# EAGLE design Power Watchdog (EAGLE 9.5.2)
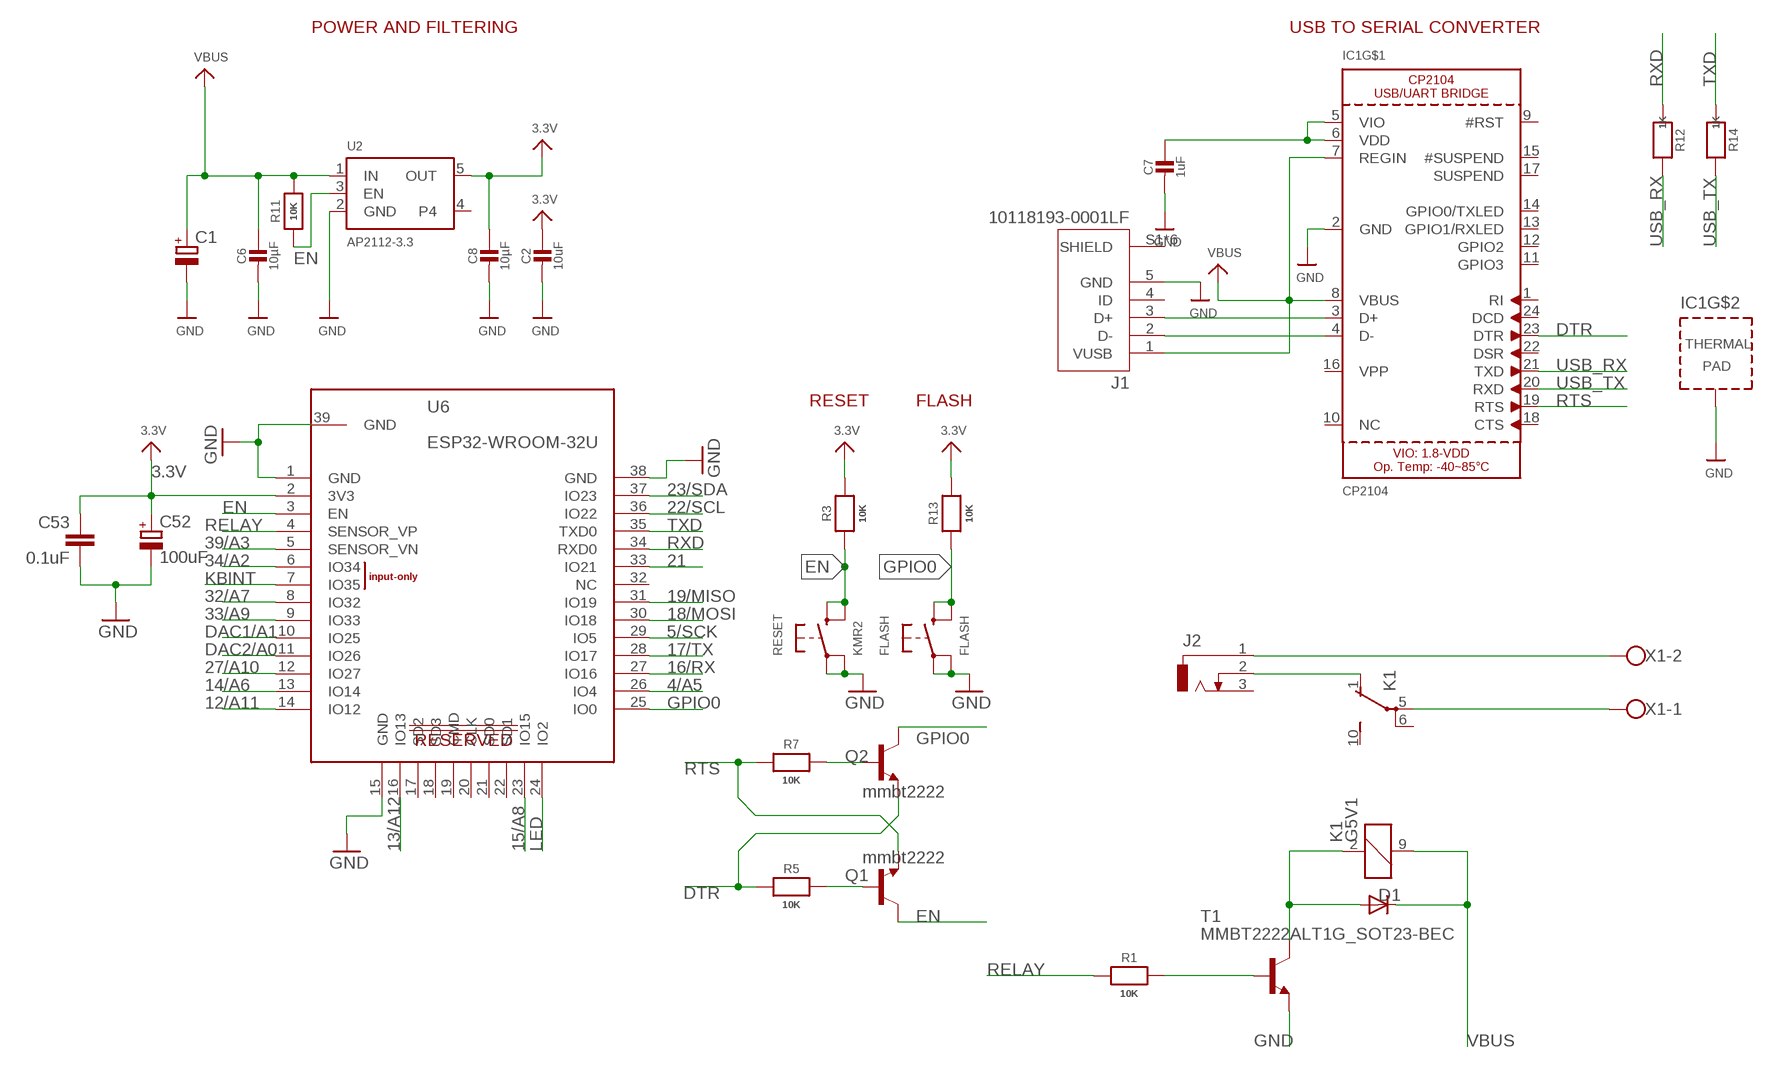
[diagram p0: schematic, sheet 1]

## Parts
C1  CPOL-EUE3.5-10  [E3,5-10]
C2  10uF  CAP_CERAMIC0805-NOOUTLINE  [0805-NO]
C6  10µF  CAP_CERAMIC0805-NOOUTLINE  [0805-NO]
C7  1uF  CAP_CERAMIC0603_NO  [0603-NO]
C8  10µF  CAP_CERAMIC0805-NOOUTLINE  [0805-NO]
C52  100uF  CPOL-EUC/6032-28R  [C/6032-28R]
C53  0.1uF  C-EUC0603  [C0603]
D1  DIODESMB  [SMB-DIODE]
FLASH  FLASH  SWITCH_TACT_SMT4.6X2.8  [BTN_KMR2_4.6X2.8]
IC1  CP2104  [QFN24_4MM_SMSC]
J1  10118193-0001LF  [FCI_10118193-0001LF]
J2  DCJ0303  [DCJ0303]
K1  G5V1  [G5V1]
Q1  mmbt2222  TRANSISTOR_NPNSOT23-3  [SOT23-3]
Q2  mmbt2222  TRANSISTOR_NPNSOT23-3  [SOT23-3]
R1  10K  RESISTOR_0603_NOOUT  [0603-NO]
R3  10K  RESISTOR_0603_NOOUT  [0603-NO]
R5  10K  RESISTOR_0603_NOOUT  [0603-NO]
R7  10K  RESISTOR_0603_NOOUT  [0603-NO]
R11  10K  RESISTOR_0603_NOOUT  [0603-NO]
R12  1K  RESISTOR_0603_NOOUT  [0603-NO]
R13  10K  RESISTOR_0603_NOOUT  [0603-NO]
R14  1K  RESISTOR_0603_NOOUT  [0603-NO]
RESET  KMR2  SWITCH_TACT_SMT4.6X2.8  [BTN_KMR2_4.6X2.8]
T1  MMBT2222ALT1G_SOT23-BEC  [SOT23-BEC]
U2  AP2112-3.3  VREG_SOT23-5  [SOT23-5]
U6  ESP32-WROOM-32U  [ESP32WROOM32D]
X1  W237-102  [W237-102]

## Nets
3.3V [3v3]: C2.1 C8.1 C52.+ C53.1 R3.2 R13.2 U2.5(OUT) U6.2(3V3)
4/A5: U6.26(IO4)
5/SCK: U6.29(IO5)
12/A11: U6.14(IO12)
13/A12: U6.16(IO13)
14/A6: U6.13(IO14)
15/A8: U6.23(IO15)
16/RX: U6.27(IO16)
17/TX: U6.28(IO17)
18/MOSI: U6.30(IO18)
19/MISO: U6.31(IO19)
21: U6.33(IO21)
22/SCL: U6.36(IO22)
23/SDA: U6.37(IO23)
27/A10: U6.12(IO27)
32/A7: U6.8(IO32)
33/A9: U6.9(IO33)
34/A2: U6.6(IO34)
39/A3: U6.5(SENSOR_VN)
DAC1/A1: U6.10(IO25)
DAC2/A0: U6.11(IO26)
DTR: IC1.23(DTR) Q2.2(E) R5.1
EN: Q1.3(C) R3.1 R11.1 RESET.B'(S1) RESET.B(S) U2.3(EN) U6.3(EN)
GND: C1.- C2.2 C6.2 C7.2 C8.2 C52.- C53.2 FLASH.A'(P1) FLASH.A(P) IC1.2(GND) IC1.THERM(TP) J1.5(GND) RESET.A'(P1) RESET.A(P) T1.E U2.2(GND) U6.1(GND) U6.15(GND) U6.38(GND) U6.39(GND)
GPIO0: FLASH.B'(S1) FLASH.B(S) Q2.3(C) R13.1 U6.25(IO0)
KBINT: U6.7(IO35)
LED: U6.24(IO2)
N$1: R1.2 T1.B
N$2: D1.A K1.2 T1.C
N$3: J2.1 X1.2
N$4: J2.2 K1.1(2:O)
N$5: K1.5(2:P) X1.1
N$6: IC1.3(D+) J1.3(D+)
N$7: IC1.4(D-) J1.2(D-)
N$9: C7.1 IC1.5(VIO) IC1.6(VDD)
N$12: Q1.1(B) R5.2
N$13: Q2.1(B) R7.2
RELAY: R1.1 U6.4(SENSOR_VP)
RTS: IC1.19(RTS) Q1.2(E) R7.1
RXD: R12.1 U6.34(RXD0)
TXD: R14.1 U6.35(TXD0)
USB_RX: IC1.21(TXD) R12.2
USB_TX: IC1.20(RXD) R14.2
VBUS [vcc]: C1.+ C6.1 D1.C IC1.7(REGIN) IC1.8(VBUS) J1.1(VUSB) K1.9 R11.2 U2.1(IN)
Unconnected: IC1.1(RI) IC1.9(#RST) IC1.10(NC) IC1.11(GPIO3) IC1.12(GPIO2) IC1.13(GPIO1/RXLED) IC1.14(GPIO0/TXLED) IC1.15(#SUSPEND) IC1.16(VPP) IC1.17(SUSPEND) IC1.18(CTS) IC1.22(DSR) IC1.24(DCD) J1.4(ID) J1.S1(SHIELD) J1.S2(SHIELD) J1.S3(SHIELD) J1.S4(SHIELD) J1.S5(SHIELD) J1.S6(SHIELD) J2.3 K1.6(2:P) K1.10(2:S) U2.4 U6.17(SD2) U6.18(SD3) U6.19(CMD) U6.20(CLK) U6.21(SD0) U6.22(SD1) U6.32(NC)

## Notes on the sheet
- POWER AND FILTERING | USB TO SERIAL CONVERTER
- RESET | FLASH
- RESERVED

## Library data of the parts
C1 = rcl:CPOL-EU: POLARIZED CAPACITOR, European symbol; SPICEPREFIX: C
C2 C6-C8 = microbuilder:CAP_CERAMIC: Ceramic Capacitors For new designs, use the packages preceded by an '_' character since they are more reliable: The following footprints should be used on most boards: _0402 - Standard footprint for regular board layouts _0603 - Standard footprint for regular board layouts _0805 - Standard footprint for regular board layouts _1206 - Standard footprint for regular board layouts For extremely tight-pitch boards where space is at a premium, the following 'micro-pitch' footprints can be used (smaller pads, no silkscreen outline, etc.): _0402MP - Micro-pitch footprint for very dense/compact boards _0603MP - Micro-pitch footprint for very dense/compact boards _0805MP - Micro-pitch footprint for very dense/compact boards _1206MP - Micro-pitch footprint for very dense/compact boards
C52 = rcl:CPOL-EU: POLARIZED CAPACITOR, European symbol
C53 = rcl:C-EU: CAPACITOR, European symbol
D1 = oriSparkFun:DIODE: Diode These are standard reverse protection diodes and small signal diodes. SMA package can handle up to about 1A. SOD-323 can handle about 200mA. What the SOD-323 package when ordering, there are some mfgs out there that are 5-pin packages.
FLASH RESET = microbuilder:SWITCH_TACT_SMT: SMT Tact Switches 6x6mm - Digikey: P12940SCT-ND KMR2 (4.6x2.8mm) - Digikey: 401-1426-1-ND EVQ-PQHB55 - Light Touch, 160GF (4.5x4.5mm) - Digikey: P8090SCT-ND KMT0 - KMT021 NGJ LHS (etc.) IP68/Waterproof - Digikey: CKN10289CT-ND
IC1 = microbuilder:CP2104: CP2104 - USB to UART Bridge VDD Output: 3.45V
J1 = 10118193-0001LF:10118193-0001LF: Micro USB B Type Receptacle; DESCRIPTION: USB - micro B USB 2.0 Receptacle Connector 5 Position Surface Mount, Right Angle; Through Hole; DIGI-KEY_PART_NUMBER: 609-4616-1-ND; DIGI-KEY_PURCHASE_URL: https://www.digikey.com/product-detail/en/amphenol-icc-fci/10118193-0001LF/609-4616-1-ND/2785380?utm_source=snapeda&utm_medium=aggregator&utm_campaign=symbol; MF: Amphenol ICC; MP: 10118193-0001LF; PACKAGE: None
J2 = con-jack:DCJ0303: DC POWER JACK Source: DCJ0303.pdf; OC_FARNELL: unknown; OC_NEWARK: unknown
K1 = relay:G5V1: RELAY 1 x switch, 0.5 A/125 V AC, 1 A/24 V DC , Omron; MPN: G5V-1-DC24; OC_FARNELL: 9949593; OC_NEWARK: 36M6377
Q1 Q2 = SparkFun:TRANSISTOR_NPN: Transistor NPN BJT configuration in SOT23 package. MMBT2222 is the common NPN we use. Double check BCE configuration again layout.
R1 R3 R5 R7 R11-R14 = microbuilder:RESISTOR: Resistors For new designs, use the packages preceded by an '_' character since they are more reliable: The following footprints should be used on most boards: _0402 - Standard footprint for regular board layouts _0603 - Standard footprint for regular board layouts _0805 - Standard footprint for regular board layouts _1206 - Standard footprint for regular board layouts For extremely tight-pitch boards where space is at a premium, the following 'micro-pitch' footprints can be used (smaller pads, no silkscreen outline, etc.): _0402MP - Micro-pitch footprint for very dense/compact boards _0603MP - Micro-pitch footprint for very dense/compact boards _0805MP - Micro-pitch footprint for very dense/compact boards _1206MP - Micro-pitch footprint for very dense/compact boards
T1 = Boobie:MMBT2222ALT1G: NPN Transistor
U2 = microbuilder:VREG_SOT23-5: SOT23-5 Fixed Voltage Regulators Part Current Out V Out V In V Dropout θJA (°C/W) TJ (°C) Digikey Part No. ADP121 150mA 3.3V 3.4-5.5V 0.09V @ 150mA -- -- ADP121-AUJZ33R7CT-ND ADP121 150mA 3.0V 3.1-5.5V 0.09V @ 150mA -- -- ADP121-AUJZ30R7CT-ND ADP122 300mA 3.3V 3.4-5.5V 0.085V @ 300mA -- -- ADP122AUJZ-3.3-R7CT-ND ADP1712 300mA 3.3V 3.5-5.5V 0.17V @ 300mA -- -- ADP1712AUJZ-3.3-R7TR-ND AP7311 (Low Cost) 150mA 3.3V 3.5-6V 0.15V @ 150mA -- -- AP7311-33WG-7DICT-ND LD39015M18R 150mA 1.8V 1.9V-5.5V 0.08V @ 100mA -- -- 497-6977-1-ND LP2985A-33DBVR 150mA 3.3V 3.3-16V 0.28V @ 150mA 206 150 296-18479-1-ND MCP1824T-3302E/OT 300mA 3.3V 3.5V-6V 0.2V @ 300mA -- -- MCP1824T-3302E/OTCT-ND MIC5205-2.5YM5 TR 150mA 2.5V 2.7-16V 0.165V @ 150mA -- -- 576-1257-2-ND MIC5205-3.0YM5 TR 150mA 3.0V 3.2V-16V 0.165V @ 150mA -- -- 576-1258-2-ND MIC5205-3.3YM5 TR 150mA 3.3V 3.5V-16V 0.165V @ 150mA -- -- 576-1259-2-ND TPS780330220 150mA 3.3V+2.2V 3.6-5.5V 250mV Max -- -- 296-23332-1-ND TDA3663/N1,135 100mA 3.3V 3.5-45V 0.18V @ 50mA -- -- 568-5343-1-ND Max operating temp can be calculated using θJA, TJ (max junction temperature), and power in watts. Set the "Maximum Ambient Temperature" until it reaches TJ ("Max Junction Temperature"), which is the absolute limit for safe use of the regulator: Heat Sink Temperature Calculator <http://www.daycounter.com/Calculators/Heat-Sink-Temperature-Calculator.phtml> For example, With 12V source into a 3.3V LP2985 and a 30mA load, we are dissipating (12V-3.3V) * 0.03A = 0.261W. With a θJA of 206 °C/W, a TJ of 150°C, and 261mW we can safely use the chip without a heat sink up to 75°C (=147.1°C Junction Temperature).
U6 = ESP32-WROOM-32U:ESP32-WROOM-32U: WiFi Modules (802.11) SMD Module, ESP32-D0WD, 32Mbits SPI flash, UART mode, U.FL antenna connector Source: Datasheet <https://www.mouser.de/datasheet/2/891/esp32-wroom-32d_esp32-wroom-32u_datasheet_en-1365844.pdf>; DESCRIPTION: WiFi Modules (802.11) SMD Module, ESP32-D0WD, 32Mbits SPI flash, UART mode, U.FL antenna connector; HEIGHT: 3.1mm; MANUFACTURER_NAME: Espressif; MANUFACTURER_PART_NUMBER: ESP32-WROOM-32U; MOUSER_PART_NUMBER: 356-ESP32-WROOM-32U
X1 = con-wago-500:W237-102: WAGO SCREW CLAMP; MPN: 237-102; OC_FARNELL: unknown; OC_NEWARK: 70K9898

## Net classes
0 default: width 0.152 mm, drill 0.305 mm, clearance 0.152 mm
1 vcc: width 0.508 mm, drill 0.559 mm, clearance 0.203 mm
2 3v3: width 0.254 mm, drill 0.381 mm

## Board
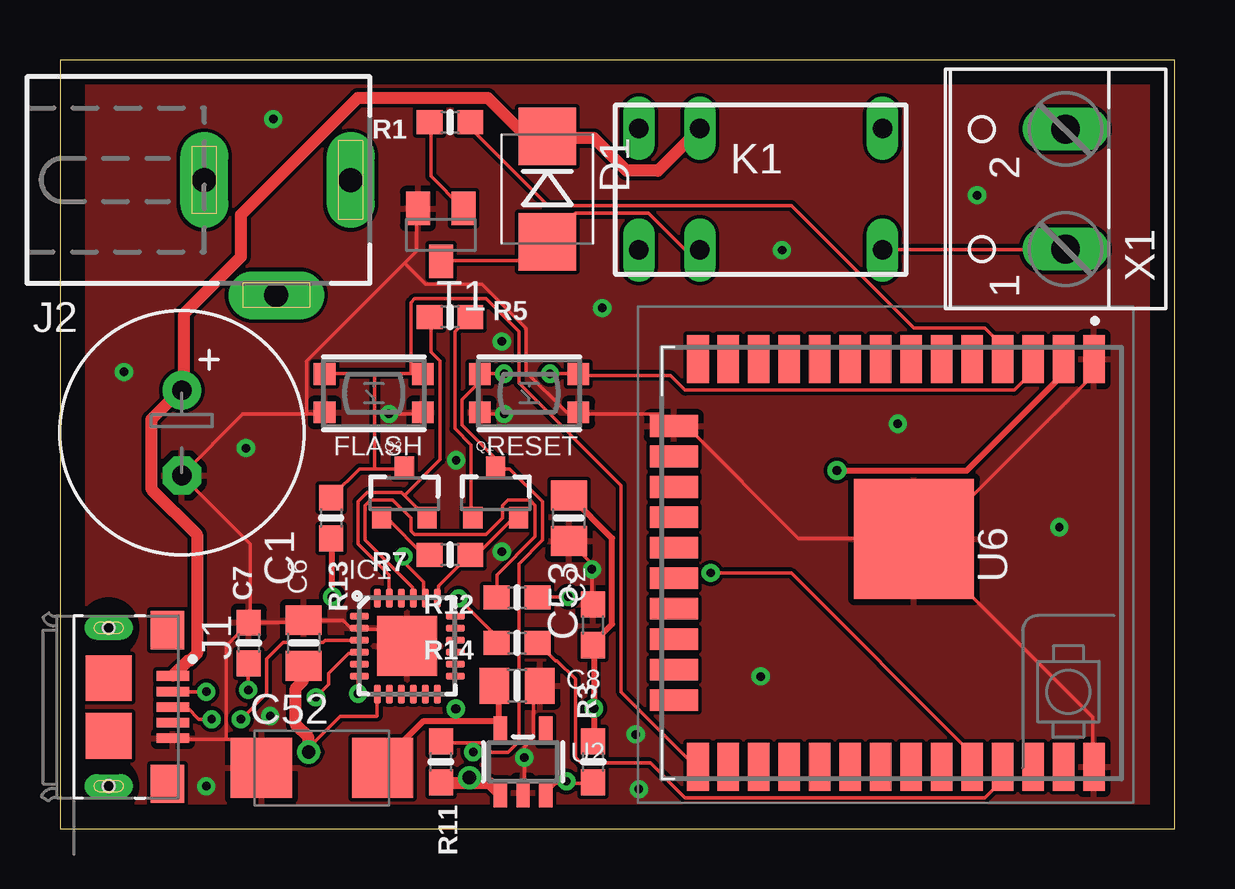
[diagram p1: board, top side]
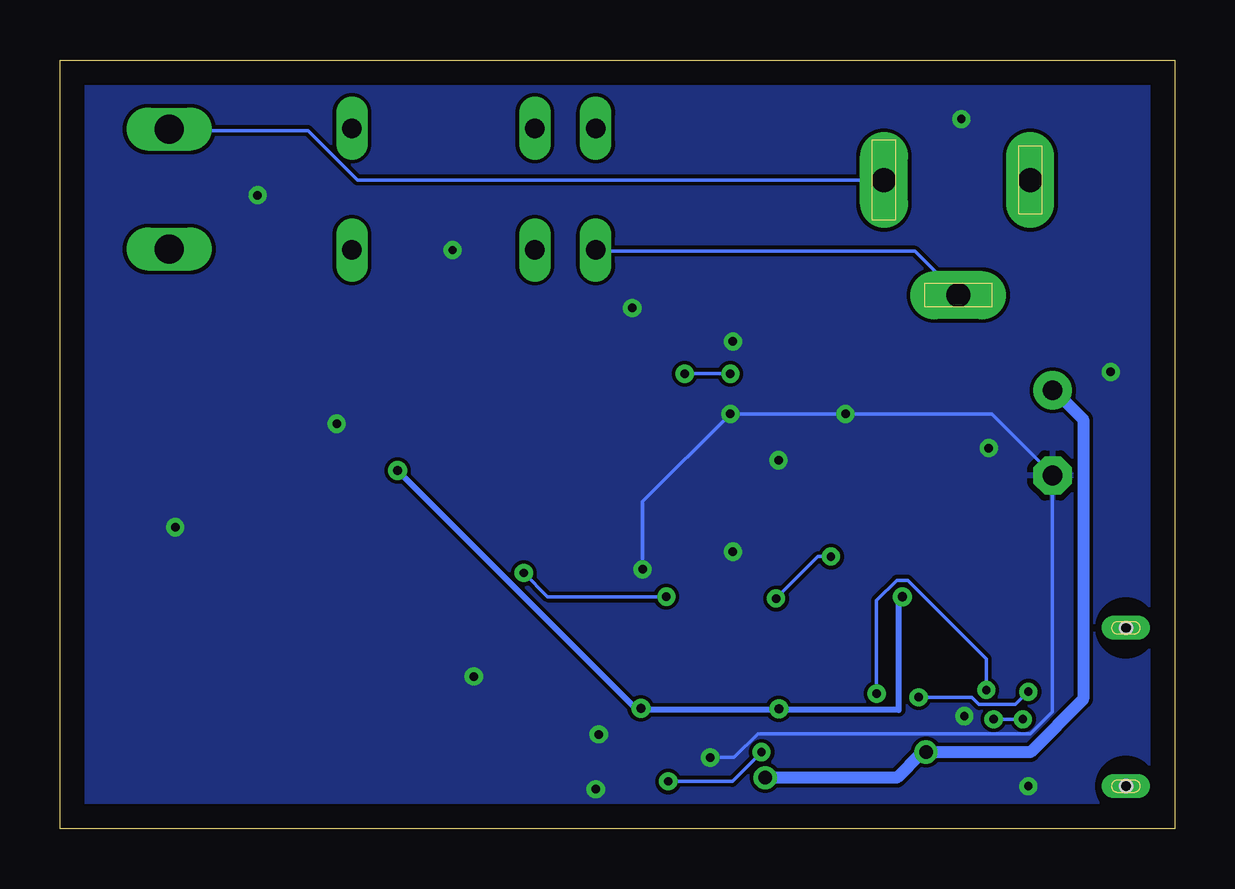
[diagram p2: board, bottom side, seen from below]

Size 46.46 x 32.05 mm. Coordinates in mm from the lower left corner, seen from the top.
Outline: 0,0 46.46,0 46.46,32.05 0,32.05 0,0
Copper layers (1*16): Top 0.035mm / dielectric 1.5mm / Bottom 0.035mm
Design rules "default": minimum track width 6mil, minimum drill 0.35mm, track to track 6mil, track to pad 6mil, pad to pad 6mil, via to via 6mil, smd to smd 6mil, copper to edge 40mil, drill to drill 6mil, minimum pad ring 10mil, minimum via ring 8mil, stop-mask expansion 4mil, vias tented up to drill 0mil, thermal gap 10mil

### Footprints (pad centres in the part's own frame; a part is rotated, then mirrored left to right if it is on the bottom)
E3,5-10 = drill 0.813 pad 1.6: + -1.778,0 | drill 0.813 pad 1.6 octagon: - 1.778,0
0805-NO = smd 1.24 x 1.5: 1 -0.95,0; 2 0.95,0
0603-NO = smd 1.075 x 1: 1 -0.85,0; 2 0.85,0
C/6032-28R = smd 2.55 x 2.5: + 2.525,0; - -2.525,0
C0603 = smd 1.1 x 1: 1 -0.85,0; 2 0.85,0
SMB-DIODE = smd 2.4 x 2.4: A 2.2,0; C -2.2,0
BTN_KMR2_4.6X2.8 = smd 0.9 x 0.9: A 2.05,0.8; A' -2.05,0.8; B 2.05,-0.8; B' -2.05,-0.8
QFN24_4MM_SMSC = smd 0.8 x 0.28: 1 -2,1.25; 2 -2,0.75; 3 -2,0.25; 4 -2,-0.25; 5 -2,-0.75; 6 -2,-1.25; 13 2,-1.25; 14 2,-0.75; 15 2,-0.25; 16 2,0.25; 17 2,0.75; 18 2,1.25 | smd 0.28 x 0.8: 7 -1.25,-2; 8 -0.75,-2; 9 -0.25,-2; 10 0.25,-2; 11 0.75,-2; 12 1.25,-2; 19 1.25,2; 20 0.75,2; 21 0.25,2; 22 -0.25,2; 23 -0.75,2; 24 -1.25,2 | smd 2.5 x 2.5: THERM 0,0
FCI_10118193-0001LF = smd 0.4 x 1.35: 1 -1.3,2.675; 2 -0.65,2.675; 3 0,2.675; 4 0.65,2.675; 5 1.3,2.675 | smd 1.6 x 1.4: S1 -3.2,2.45; S2 3.2,2.45 | smd 1.9 x 1.9: S3 1.2,0; S4 -1.2,0 | drill 0.5 pad 0.9 long: S5 -3.3,0; S6 3.3,0 | hole 0.5: -3.3,0; 3.3,0
DCJ0303 = drill 1 pad 2 long: 1 0,3.1; 2 4.8,0; 3 0,-3
G5V1 = drill 0.813 long: 1 -5.08,-2.54; 2 -2.54,-2.54; 5 5.08,-2.54; 6 5.08,2.54; 9 -2.54,2.54; 10 -5.08,2.54
SOT23-3 = smd 0.8 x 0.9: 1 -0.95,-1; 2 0.95,-1; 3 0,1.1
SOT23-BEC = smd 1 x 1.4: B -0.95,-1.1; C 0,1.1; E 0.95,-1.1
SOT23-5 = smd 0.55 x 1.2: 1 -0.95,-1.3; 2 0,-1.3; 3 0.95,-1.3; 4 0.95,1.3; 5 -0.95,1.3
ESP32WROOM32D = smd 2 x 0.9: 1 -8.15,5.51; 2 -8.15,4.24; 3 -8.15,2.97; 4 -8.15,1.7; 5 -8.15,0.43; 6 -8.15,-0.84; 7 -8.15,-2.11; 8 -8.15,-3.38; 9 -8.15,-4.65; 10 -8.15,-5.92; 11 -8.15,-7.19; 12 -8.15,-8.46; 13 -8.15,-9.73; 14 -8.15,-11; 25 8.85,-11; 26 8.85,-9.73; 27 8.85,-8.46; 28 8.85,-7.19; 29 8.85,-5.92; 30 8.85,-4.65; 31 8.85,-3.38; 32 8.85,-2.11; 33 8.85,-0.84; 34 8.85,0.43; 35 8.85,1.7; 36 8.85,2.97; 37 8.85,4.24; 38 8.85,5.51 | smd 0.9 x 2: 15 -5.365,-12; 16 -4.095,-12; 17 -2.825,-12; 18 -1.555,-12; 19 -0.285,-12; 20 0.985,-12; 21 2.255,-12; 22 3.525,-12; 23 4.795,-12; 24 6.065,-12 | smd 5 x 5: 39 -0.65,-1.99
W237-102 = drill 1.194 long: 1 -2.5,-1.27; 2 2.5,-1.27

### Placement (x,y rotation side)
C1  5.08,16.51 270 top
C2  21.21,12.95 270 top
C6  10.16,7.75 90 top
C7  7.87,7.75 90 top
C8  19.05,5.97 0 top
C52  10.92,2.54 0 top
C53  22.23,8.51 90 top
D1  20.32,26.67 270 top
FLASH  13.08,18.16 180 top
IC1  14.48,7.62 0 top
J1  2.03,5.08 270 top
J2  9.02,27.05 270 top
K1  29.21,26.67 0 top
Q1  18.16,13.97 0 top
Q2  14.35,13.97 0 top
R1  16.26,29.46 180 top
R3  22.23,2.79 90 top
R5  16.26,21.34 0 top
R7  16.26,11.43 180 top
R11  15.88,2.79 270 top
R12  19.05,9.65 180 top
R13  11.3,12.95 270 top
R14  19.05,7.75 180 top
RESET  19.56,18.16 180 top
T1  15.88,24.77 180 top
U2  19.3,2.79 0 top
U6  37.59,11.43 270 top
X1  40.64,26.67 90 top

### Tracks (layer width: path | path; a pad name or v marks a point on that pad's centre or on a via)
3.3V  (via drill 0.38)
  Top 0.254: R3.2 22.25,3.66 v22.25,5.03 22.25,7.62 C53.1 22.25,7.77 23.01,8.53 23.01,12.12 21.26,13.87 C2.1 | C8.1 18.14,5.94 18.29,5.79 18.29,4.12 U2.5 18.21,4.5 16.5,4.5 | v11.35,9.68 11.35,12.04 R13.2 | 13.41,2.59 C52.+ 13.41,2.74 15.16,4.5 16.5,4.5 | v32.38,14.94 37.8,14.94 41.76,18.9 41.76,19.51 U6.2 | 16.5,4.5 v16.5,5
  Bottom 0.254: v32.38,14.94 22.4,4.95 22.25,4.95 | 16.5,4.95 11.5,4.95 11.5,9.5 v11.35,9.68 | 16.5,4.95 22.25,4.95 | v22.25,5.03 22.25,4.95 | v16.5,5 16.5,4.95
DTR
  Top 0.152: 14.36,13.91 15.24,13.03 Q2.2 | 14.36,13.91 14.25,14.02 12.8,14.02 12.42,13.64 12.42,11.89 13.72,10.59 13.72,9.68 IC1.23 | 14.36,13.91 15.85,15.39 15.85,19.51 15.47,19.89 15.47,21.34 R5.1
EN  (via drill 0.35)
  Top 0.152: U6.3 40.54,19.51 40.54,19.05 39.78,18.29 26.06,18.29 25.45,18.9 21.64,18.9 RESET.B' 21.57,18.97 v20.42,18.97 | 21.11,1.91 20.65,1.91 20.27,1.52 U2.3 | 21.11,1.91 22.17,1.91 R3.1 | 17.22,3.58 17.6,3.58 17.98,3.2 18.67,3.2 19.13,3.66 19.13,11.05 20.12,12.04 20.12,13.64 18.75,15.01 18.21,15.01 Q1.3 18.14,15.09 18.14,15.47 16.76,16.84 16.76,17.91 17.45,18.59 17.45,18.9 RESET.B 17.53,18.97 v18.52,18.97 | 17.22,3.58 15.93,3.58 R11.1 | v21.11,1.98 21.11,1.91 | 17.22,3.58 v17.22,3.2
  Bottom 0.152: v21.11,1.98 18.44,1.98 v17.22,3.2 | v18.52,18.97 v20.42,18.97
GND  (via drill 0.35)
  Top 0.152: U6.38 43.05,2.59 43.05,4.65 35.66,12.04 U6.39 | U6.1 43.05,19.51 43.05,18.9 35.97,11.81 U6.39 | 6.93,3.73 7.24,3.73 8.38,2.59 C52.- | 6.93,3.73 4.72,3.73 J1.5 | C7.2 7.92,8.61 10.06,8.61 10.13,8.69 C6.2 10.21,8.69 11.81,8.69 12.12,8.38 12.42,8.38 IC1.2 12.5,8.31 13.79,8.31 IC1.THERM | 6.93,3.73 6.93,7.62 7.85,8.53 C7.2 | U2.2 19.36,1.52 v19.36,2.97 19.36,3.43 19.74,3.81 19.74,5.71 19.96,5.94 C8.2 | C53.2 22.17,9.37 v22.17,10.82 22.17,11.05 21.26,11.96 C2.2 | 10.29,17.3 7.62,17.3 5.11,14.78 C1.- 7.92,11.89 7.92,8.69 C7.2 | 10.29,17.3 10.97,17.3 FLASH.A | v13.72,17.3 15.09,17.3 FLASH.A' | v18.52,17.3 17.53,17.3 RESET.A | 14.36,23.58 10.29,19.51 10.29,17.3 | 14.36,23.58 14.86,24.08 14.86,25.83 T1.E | 14.36,23.58 15.24,22.71 17.6,22.71 19.43,20.88 19.43,19.05 21.11,17.37 21.57,17.37 RESET.A' 21.64,17.3 25.07,17.3 25.53,16.84 U6.15 25.6,16.76 26.14,16.76 30.79,12.12 35.59,12.12 U6.39
  Bottom 0.152: v22.17,10.82 22.17,13.64 v18.52,17.3 v13.72,17.3 7.62,17.3 5.11,14.78 C1.- 5.11,14.71 5.11,4.88 6.02,3.96 17.37,3.96 18.36,2.97 v19.36,2.97
  other vias: 29.21,6.35 24,3.94 24.13,1.65 8.89,29.59 2.67,19.05 7.75,15.88 22.61,21.72 16.51,15.37 18.41,20.32 18.41,11.56 41.66,12.57 34.92,16.89 38.23,26.42 30.1,24.13 8.76,4.7 6.1,1.78
  pour Top: -2.54,34.29 49.53,34.29 55.88,27.94 55.88,5.08 49.53,-1.27 -1.27,-1.27 -7.62,5.08 -7.62,29.21
  pour Bottom: -5.08,35.56 54.61,35.56 60.96,29.21 60.96,2.54 55.88,-2.54 -2.54,-2.54 -11.43,6.35 -11.43,29.21 -6.35,34.29
GPIO0
  Top 0.152: 13.11,15.01 12.5,15.01 11.35,13.87 R13.1 | 13.11,15.01 14.33,15.01 Q2.3 | 14.63,18.97 15.09,18.97 FLASH.B' | 14.63,18.97 13.11,18.97 | 13.11,18.97 11.05,18.97 FLASH.B | 14.63,18.97 14.63,21.95 14.78,22.1 17.75,22.1 19.13,20.73 19.13,18.59 23.39,14.33 23.39,5.71 26.52,2.59 U6.25 | 13.11,18.97 13.11,15.01
N$1
  Top 0.152: R1.2 15.47,29.41 15.47,27.2 16.76,25.91 T1.B
N$2
  Top 0.152: T1.C 15.93,23.7 19.51,23.7 20.27,24.46 D1.A 20.34,24.54 21.49,25.68 24.54,25.68 26.06,24.16 26.67,24.16 K1.2
N$3
  Bottom 0.152: J2.1 34.06,27.05 36.12,29.11 41.91,29.11 X1.2
N$4
  Bottom 0.152: K1.1 24.08,24.08 10.82,24.08 9.07,22.33 J2.2
N$5
  Top 0.152: K1.5 34.29,24.16 41.91,24.16 X1.1
N$6  (via drill 0.35)
  Top 0.152: v7.54,4.57 8.61,5.64 8.61,7.09 9.3,7.77 10.97,7.77 11.05,7.85 12.42,7.85 IC1.3 | v6.33,4.57 5.79,4.57 5.33,5.03 4.72,5.03 J1.3
  Bottom 0.152: v6.33,4.57 v7.54,4.57
N$7  (via drill 0.35)
  Top 0.152: v10.67,5.49 11.2,6.02 11.2,6.48 12.04,7.32 12.42,7.32 IC1.4 | v6.1,5.71 4.72,5.71 J1.2
  Bottom 0.152: v10.67,5.49 8.46,5.49 8.15,5.18 6.63,5.18 v6.1,5.71
N$9  (via drill 0.35)
  Top 0.152: IC1.5 12.5,6.86 12.5,6.4 IC1.6 12.42,6.33 v12.42,5.64 | v7.85,5.79 7.85,6.86 C7.1
  Bottom 0.152: v12.42,5.64 12.42,9.53 11.58,10.36 11.12,10.36 7.85,7.09 v7.85,5.79
N$12
  Top 0.152: Q1.1 17.14,13.03 17.14,16 16.46,16.69 16.46,20.73 17.07,21.34 R5.2
N$13
  Top 0.152: R7.2 15.16,11.43 13.64,12.95 13.41,12.95 Q2.1
RELAY
  Top 0.152: R1.1 17.14,29.41 17.14,29.18 20.34,25.98 30.48,25.98 35.59,20.88 38.56,20.88 39.24,20.19 39.24,19.58 U6.4
RTS
  Top 0.152: IC1.19 15.77,9.68 15.77,10.13 17.07,11.43 R7.1 17.37,11.43 18.9,12.95 19.05,12.95 Q1.2
RXD  (via drill 0.35)
  Top 0.152: v21.18,9.68 19.96,9.68 R12.1 | v27.13,10.67 30.48,10.67 37.95,3.2 37.95,2.59 U6.34
  Bottom 0.152: v21.18,9.68 26.14,9.68 v27.13,10.67
TXD
  Top 0.152: R14.1 19.96,7.7 20.65,7.01 20.73,7.01 21.49,6.25 21.49,2.97 21.72,2.74 24.61,2.74 26.06,1.29 38.56,1.29 39.24,1.98 39.24,2.52 U6.35
USB_RX
  Top 0.152: IC1.21 14.71,9.68 14.71,10.06 12.72,12.04 12.72,13.49 12.95,13.72 13.87,13.72 14.63,12.95 14.63,12.42 14.78,12.27 17.75,12.27 18.44,12.95 18.44,13.49 18.67,13.72 19.58,13.72 19.81,13.49 19.81,12.19 18.21,10.59 18.21,9.68 R12.2
USB_TX  (via drill 0.35)
  Top 0.152: v14.33,11.35 14.33,11.12 15.16,10.29 15.16,9.68 IC1.20 | v16.61,9.6 18.14,8.08 18.14,7.77 R14.2
  Bottom 0.152: v14.33,11.35 14.86,11.35 v16.61,9.6
VBUS  (via drill 0.56)
  Top 0.15: IC1.8 IC1.7 13.23,4.72 13.21,4.7 11.68,4.7 10.36,3.38 v10.36,3.2 10.81,3.2
  Top 0.508: K1.9 26.67,29.18 24.92,27.43 23.62,27.43 22.25,28.8 20.34,28.8 D1.C 20.12,29.03 19.28,29.03 17.83,30.48 12.42,30.48 7.54,25.6 7.54,23.85 5.18,21.49 5.18,18.52 C1.+ 5.03,18.29 3.81,17.07 3.81,14.17 5.71,12.27 5.71,7.32 5.41,7.01 5.33,7.01 4.72,6.4 J1.1 | 17.07,1.91 17.91,1.91 18.29,1.52 U2.1 | 17.07,1.91 15.93,1.91 R11.2 | v10.36,3.2 10.36,3.81 9.83,4.34 9.83,5.87 10.13,6.17 10.13,6.78 C6.1 | v17.07,2.13 17.07,1.91
  Bottom 0.508: C1.+ 5.03,18.29 3.81,17.07 3.81,5.41 6.02,3.2 v10.36,3.2 10.59,3.12 11.58,2.13 v17.07,2.13